# EAGLE design FlightControl (EAGLE 6.5.0)
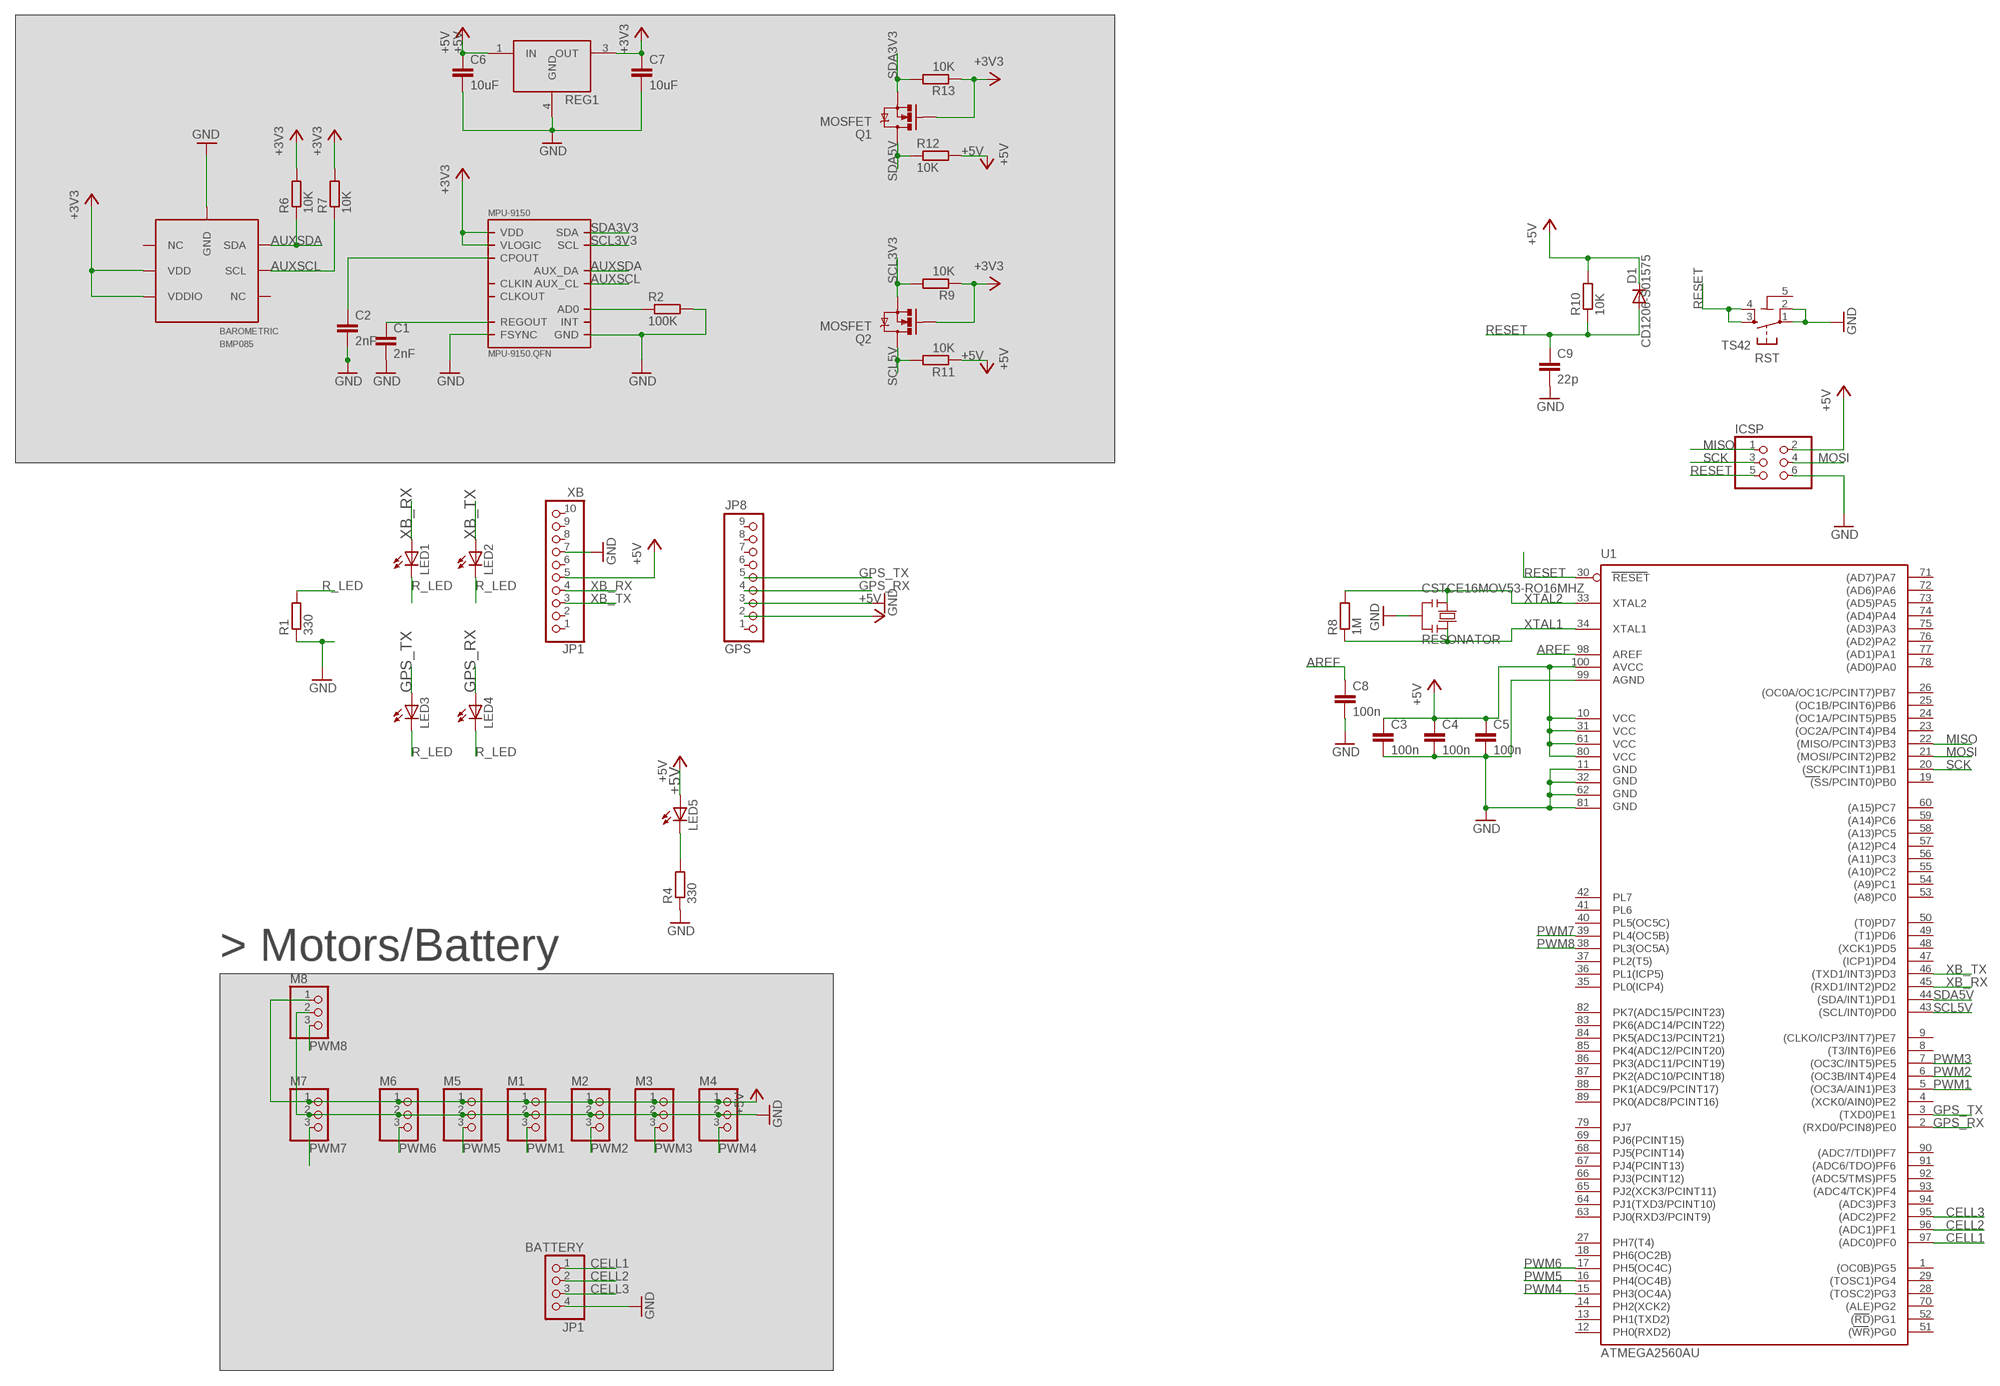
[diagram p0: schematic, sheet 1]

## Parts
BAROMETRIC  BMP085  [7LGA]
BATTERY  JP1  PINHD-1X4  [1X04]
C1  2nF  C-EUC0603  [C0603-ROUND]
C2  2nF  C-EUC0603  [C0603-ROUND]
C3  100n  C-EU0603-RND  [C0603-ROUND]
C4  100n  C-EU0603-RND  [C0603-ROUND]
C5  100n  C-EU0603-RND  [C0603-ROUND]
C6  10uF  CAPEZ  [CAP-PTH-SMALLEZ]
C7  10uF  CAPEZ  [CAP-PTH-SMALLEZ]
C8  100n  C-EU0603-RND  [C0603-ROUND]
C9  22p  C-EU0603-RND  [C0603-ROUND]
CSTCE16MOV53-RO16MHZ  RESONATOR  RESONATORMU  [RESONATOR]
D1  CD1206-S01575  DIODE-MINIMELF  [MINIMELF]
GPS  JP8  PINHD-1X9  [1X09]
ICSP  PINHD-2X3  [2X03]
JP1  XB  PINHD-1X10_ARD  [1X10]
LED1  LEDCHIPLED_1206  [CHIPLED_1206]
LED2  LEDCHIPLED_1206  [CHIPLED_1206]
LED3  LEDCHIPLED_1206  [CHIPLED_1206]
LED4  LEDCHIPLED_1206  [CHIPLED_1206]
LED5  LEDCHIPLED_1206  [CHIPLED_1206]
M1  PINHD-1X3  [1X03]
M2  PINHD-1X3  [1X03]
M3  PINHD-1X3  [1X03]
M4  PINHD-1X3  [1X03]
M5  PINHD-1X3  [1X03]
M6  PINHD-1X3  [1X03]
M7  PINHD-1X3  [1X03]
M8  PINHD-1X3  [1X03]
MPU-9150  MPU-9150.QFN  [QFN.24.4X4]
Q1  MOSFET  MOSFET-NCHANNELBSS138  [SOT23]
Q2  MOSFET  MOSFET-NCHANNELBSS138  [SOT23]
R1  330  R-EU_0603-RND  [R0603-ROUND]
R2  100K  R-EU_0603-RND  [R0603-ROUND]
R4  330  R-EU_0603-RND  [R0603-ROUND]
R6  10K  R-EU_0603-RND  [R0603-ROUND]
R7  10K  R-EU_0603-RND  [R0603-ROUND]
R8  1M  R-EU_R0603  [R0603-ROUND]
R9  10K  R-EU_R0603  [R0603-ROUND]
R10  10K  R-EU_R0603  [R0603-ROUND]
R11  10K  R-EU_R0603  [R0603-ROUND]
R12  10K  R-EU_R0603  [R0603-ROUND]
R13  10K  R-EU_R0603  [R0603-ROUND]
REG1  LD39300  [DPAK]
RST  TS42  [TS42]
U1  ATMEGA2560AU  [TQFP100]

## Nets
+3V3: BAROMETRIC.2(VDD) BAROMETRIC.3(VDDIO) C7.1 MPU-9150.3(VDD) MPU-9150.8(VLOGIC) MPU-9150.13(VDD) Q1.1(G) Q2.1(G) R6.2 R7.2 R9.1 R13.1 REG1.3(OUT)
+5V: C3.1 C4.1 C5.1 C6.1 D1.C GPS.2 ICSP.2 JP1.5 LED5.A M1.1 M2.1 M3.1 M4.1 M5.1 M6.1 M7.1 M8.1 R10.2 R11.1 R12.2 REG1.1(IN) U1.10(VCC) U1.31(VCC1) U1.61(VCC2) U1.80(VCC3) U1.100(AVCC)
AD0: MPU-9150.9(AD0) R2.1
AREF: C8.1 U1.98(AREF)
AUXSCL: BAROMETRIC.5(SCL) MPU-9150.7(AUX_CL) R7.1
AUXSDA: BAROMETRIC.6(SDA) MPU-9150.6(AUX_DA) R6.1
CELL1: BATTERY.1 U1.97((ADC0)PF0)
CELL2: BATTERY.2 U1.96((ADC1)PF1)
CELL3: BATTERY.3 U1.95((ADC2)PF2)
CPOUT: C2.1 MPU-9150.20(CPOUT)
GND: BAROMETRIC.7(GND) BATTERY.4 C1.2 C2.2 C3.2 C4.2 C5.2 C6.2 C7.2 C8.2 C9.2 CSTCE16MOV53-RO16MHZ.2 GPS.3 ICSP.6 JP1.7 M1.2 M2.2 M3.2 M4.2 M5.2 M6.2 M7.2 M8.2 MPU-9150.11(FSYNC) MPU-9150.15(GND) MPU-9150.17(GND) MPU-9150.18(GND) R1.1 R2.2 R4.1 REG1.4(GND) RST.1 RST.2 U1.11(GND) U1.32(GND1) U1.62(GND2) U1.81(GND3) U1.99(AGND)
GPS_RX: GPS.4 LED4.A U1.2((RXD0/PCIN8)PE0)
GPS_TX: GPS.5 LED3.A U1.3((TXD0)PE1)
MISO: ICSP.1 U1.22((MISO/PCINT3)PB3)
MOSI: ICSP.4 U1.21((MOSI/PCINT2)PB2)
N$7: LED5.C R4.2
PWM1: M1.3 U1.5((OC3A/AIN1)PE3)
PWM2: M2.3 U1.6((OC3B/INT4)PE4)
PWM3: M3.3 U1.7((OC3C/INT5)PE5)
PWM4: M4.3 U1.15(PH3(OC4A))
PWM5: M5.3 U1.16(PH4(OC4B))
PWM6: M6.3 U1.17(PH5(OC4C))
PWM7: M7.3 U1.39(PL4(OC5B))
PWM8: M8.3 U1.38(PL3(OC5A))
R_LED: LED1.C LED2.C LED3.C LED4.C R1.2
REGOUT: C1.1 MPU-9150.10(REGOUT)
RESET: C9.1 D1.A ICSP.5 R10.1 RST.3 RST.4 U1.30(RESET)
SCK: ICSP.3 U1.20((SCK/PCINT1)PB1)
SCL3V3: MPU-9150.23(SCL) Q2.2(S) R9.2
SCL5V: Q2.3(D) R11.2 U1.43((SCL/INT0)PD0)
SDA3V3: MPU-9150.24(SDA) Q1.2(S) R13.2
SDA5V: Q1.3(D) R12.1 U1.44((SDA/INT1)PD1)
XB_RX: JP1.4 LED1.A U1.45((RXD1/INT2)PD2)
XB_TX: JP1.3 LED2.A U1.46((TXD1/INT3)PD3)
XTAL1: CSTCE16MOV53-RO16MHZ.3 R8.1 U1.34(XTAL1)
XTAL2: CSTCE16MOV53-RO16MHZ.1 R8.2 U1.33(XTAL2)
Unconnected: BAROMETRIC.1(NC) BAROMETRIC.4(NC) GPS.1 GPS.6 GPS.7 GPS.8 GPS.9 JP1.1 JP1.2 JP1.6 JP1.8 JP1.9 JP1.10 MPU-9150.1(CLKIN) MPU-9150.12(INT) MPU-9150.22(CLKOUT) U1.1((OC0B)PG5) U1.4((XCK0/AIN0)PE2) U1.8((T3/INT6)PE6) U1.9((CLKO/ICP3/INT7)PE7) U1.12(PH0(RXD2)) U1.13(PH1(TXD2)) U1.14(PH2(XCK2)) U1.18(PH6(OC2B)) U1.19((SS/PCINT0)PB0) U1.23((OC2A/PCINT4)PB4) U1.24((OC1A/PCINT5)PB5) U1.25((OC1B/PCINT6)PB6) U1.26((OC0A/OC1C/PCINT7)PB7) U1.27(PH7(T4)) U1.28((TOSC2)PG3) U1.29((TOSC1)PG4) U1.35(PL0(ICP4)) U1.36(PL1(ICP5)) U1.37(PL2(T5)) U1.40(PL5(OC5C)) U1.41(PL6) U1.42(PL7) U1.47((ICP1)PD4) U1.48((XCK1)PD5) U1.49((T1)PD6) U1.50((T0)PD7) U1.51((WR)PG0) U1.52((RD)PG1) U1.53((A8)PC0) U1.54((A9)PC1) U1.55((A10)PC2) U1.56((A11)PC3) U1.57((A12)PC4) U1.58((A13)PC5) U1.59((A14)PC6) U1.60((A15)PC7) U1.63(PJ0(RXD3/PCINT9)) U1.64(PJ1(TXD3/PCINT10)) U1.65(PJ2(XCK3/PCINT11)) U1.66(PJ3(PCINT12)) U1.67(PJ4(PCINT13)) U1.68(PJ5(PCINT14)) U1.69(PJ6(PCINT15)) U1.70((ALE)PG2) U1.71((AD7)PA7) U1.72((AD6)PA6) U1.73((AD5)PA5) U1.74((AD4)PA4) U1.75((AD3)PA3) U1.76((AD2)PA2) U1.77((AD1)PA1) U1.78((AD0)PA0) U1.79(PJ7) U1.82(PK7(ADC15/PCINT23)) U1.83(PK6(ADC14/PCINT22)) U1.84(PK5(ADC13/PCINT21)) U1.85(PK4(ADC12/PCINT20)) U1.86(PK3(ADC11/PCINT19)) U1.87(PK2(ADC10/PCINT18)) U1.88(PK1(ADC9/PCINT17)) U1.89(PK0(ADC8/PCINT16)) U1.90((ADC7/TDI)PF7) U1.91((ADC6/TDO)PF6) U1.92((ADC5/TMS)PF5) U1.93((ADC4/TCK)PF4) U1.94((ADC3)PF3)

## Notes on the sheet
- > Motors/Battery

## Power pins joined to a net without a drawn wire
5-GND: RST.5(5-GND)

## Library data of the parts
BAROMETRIC = MyLibrary:BMP085
BATTERY = pinhead:PINHD-1X4: PIN HEADER
C1-C5 C8 C9 = SmartPrj:C-EU: CAPACITOR, European symbol
C6 C7 = SparkFun-Capacitors:CAP: Capacitor Standard 0603 ceramic capacitor, and 0.1" leaded capacitor.
CSTCE16MOV53-RO16MHZ = SmartPrj:RESONATOR
D1 = diode:DIODE-: DIODE
GPS = pinhead:PINHD-1X9: PIN HEADER
ICSP = SmartPrj:PINHD-2X3: PIN HEADER
JP1 = SmartPrj:PINHD-1X10_ARD: PIN HEADER
LED1-LED5 = adafruit:LED: LED OSRAM: - CHIPLED LG R971, LG N971, LY N971, LG Q971, LY Q971, LO R971, LY R971 LH N974, LH R974 LS Q976, LO Q976, LY Q976 LO Q996 - Hyper CHIPLED LW Q18S LB Q993, LB Q99A, LB R99A - SideLED LS A670, LO A670, LY A670, LG A670, LP A670 LB A673, LV A673, LT A673, LW A673 LH A674 LY A675 LS A676, LA A676, LO A676, LY A676, LW A676 LS A679, LY A679, LG A679 - Hyper Micro SIDELED® LS Y876, LA Y876, LO Y876, LY Y876 LT Y87S - SmartLED LW L88C, LW L88S LB L89C, LB L89S, LG L890 LS L89K, LO L89K, LY L89K LS L896, LA L896, LO L896, LY L896 - TOPLED LS T670, LO T670, LY T670, LG T670, LP T670 LSG T670, LSP T670, LSY T670, LOP T670, LYG T670 LG T671, LOG T671, LSG T671 LB T673, LV T673, LT T673, LW T673 LH T674 LS T676, LA T676, LO T676, LY T676, LB T676, LH T676, LSB T676, LW T676 LB T67C, LV T67C, LT T67C, LS T67K, LO T67K, LY T67K, LW E67C LS E67B, LA E67B, LO E67B, LY E67B, LB E67C, LV E67C, LT E67C LW T67C LS T679, LY T679, LG T679 LS T770, LO T770, LY T770, LG T770, LP T770 LB T773, LV T773, LT T773, LW T773 LH T774 LS E675, LA E675, LY E675, LS T675 LS T776, LA T776, LO T776, LY T776, LB T776 LHGB T686 LT T68C, LB T68C - Hyper Mini TOPLED® LB M676 - Mini TOPLED Santana® LG M470 LS M47K, LO M47K, LY M47K Source: http://www.osram.convergy.de/
M1-M8 = pinhead:PINHD-1X3: PIN HEADER
MPU-9150 = invensense:MPU-9150
Q1 Q2 = SparkFun-DiscreteSemi:MOSFET-NCHANNEL: Common NMOSFET Parts MFG P/N Store ID Prod ID FDD8780 TRANS-09984 SI7820DN TRANS-11055 FDS6630A IC-08089 2N7002PW TRANS-11151 FQP30N06L COM-10213 TRANS-10060 BSS123LT1G TRANS-08345 BSS138 TRANS-00830 BS170 2N7000; PROD_ID: TRANS-00830
R1 R2 R4 R6-R13 = SmartPrj:R-EU_: RESISTOR, European symbol
REG1 = v-reg:LD39300
RST = SmartPrj:TS42: TS42 Dongnan Electronics Tact switch VDC 12V - 50mA
U1 = SparkFun-DigitalIC:ATMEGA2560: Atmel 100-pin 8-bit uC 64/128/256 Kbytes FLASH 4 Kbytes EEPROM 8 Kbytes SRAM 86 General Purpose I/O pins 12-channels16-bit PWM 4 x Serial USARTs 16-channels 10-bit A/D

## Net classes
0 default: clearance 0.205 mm

## Board
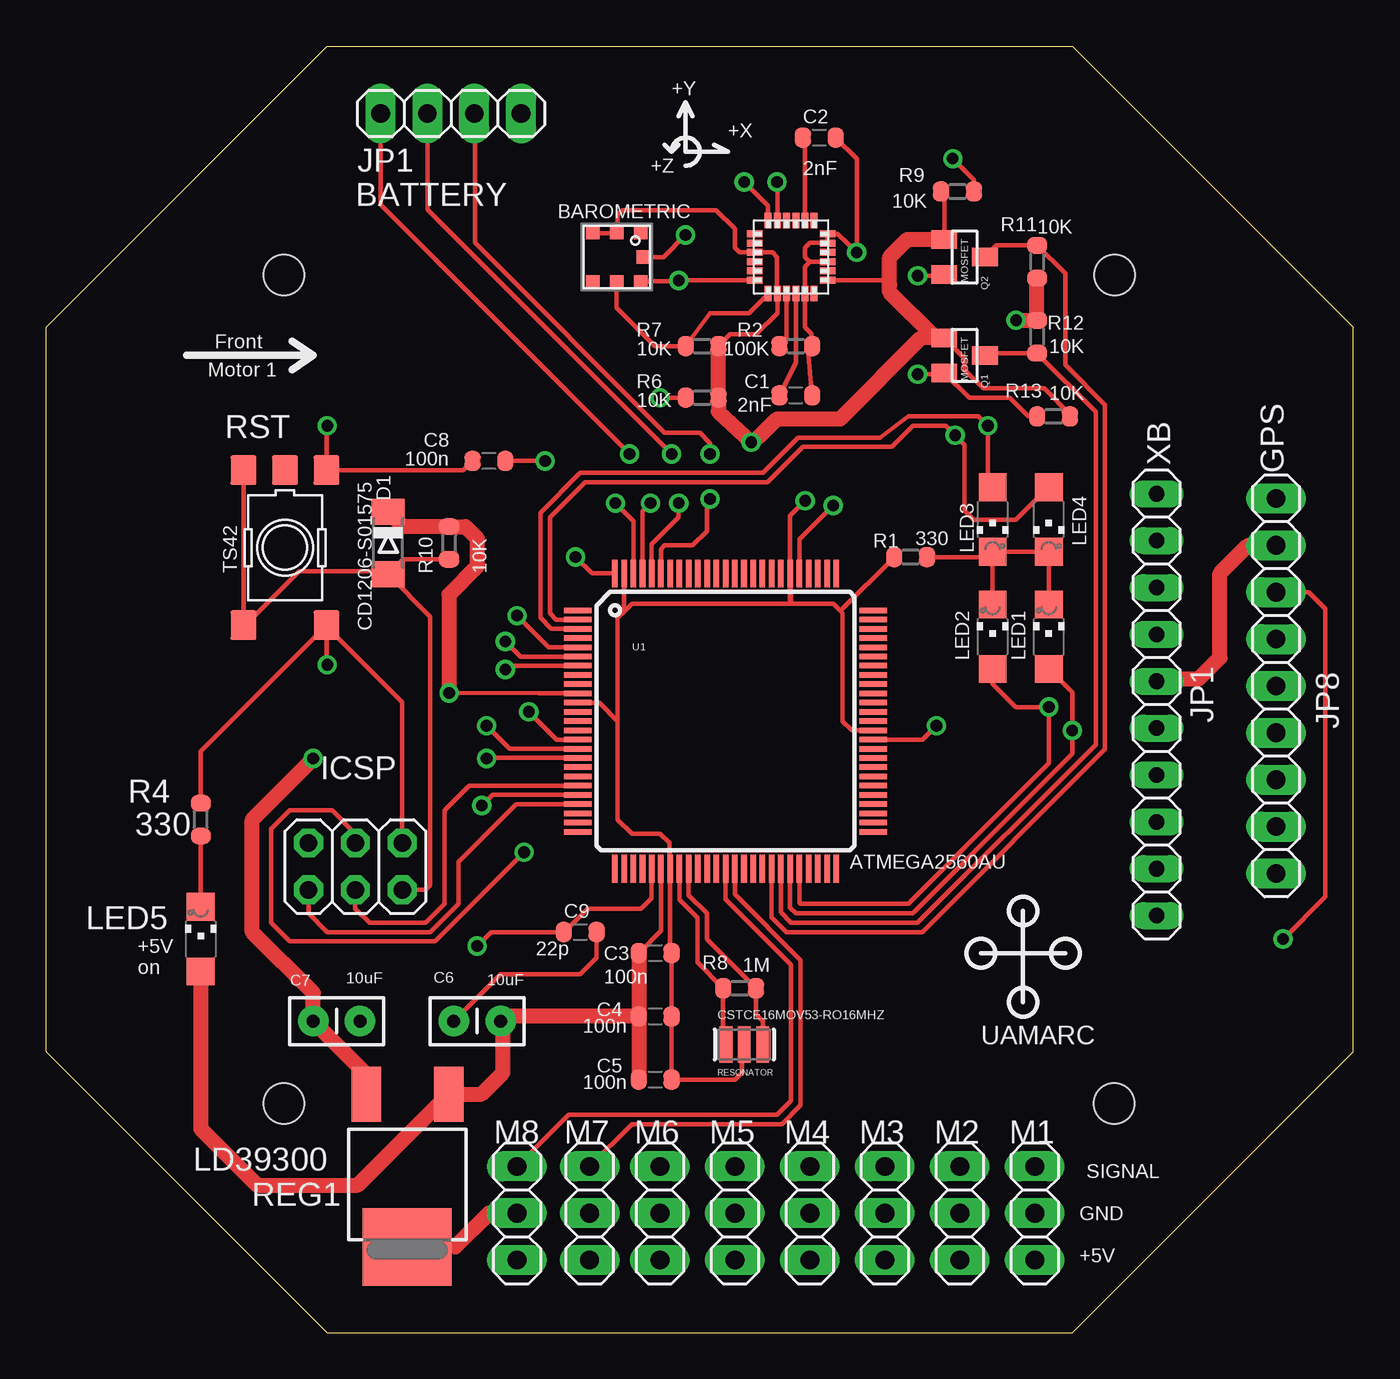
[diagram p1: board, top side]
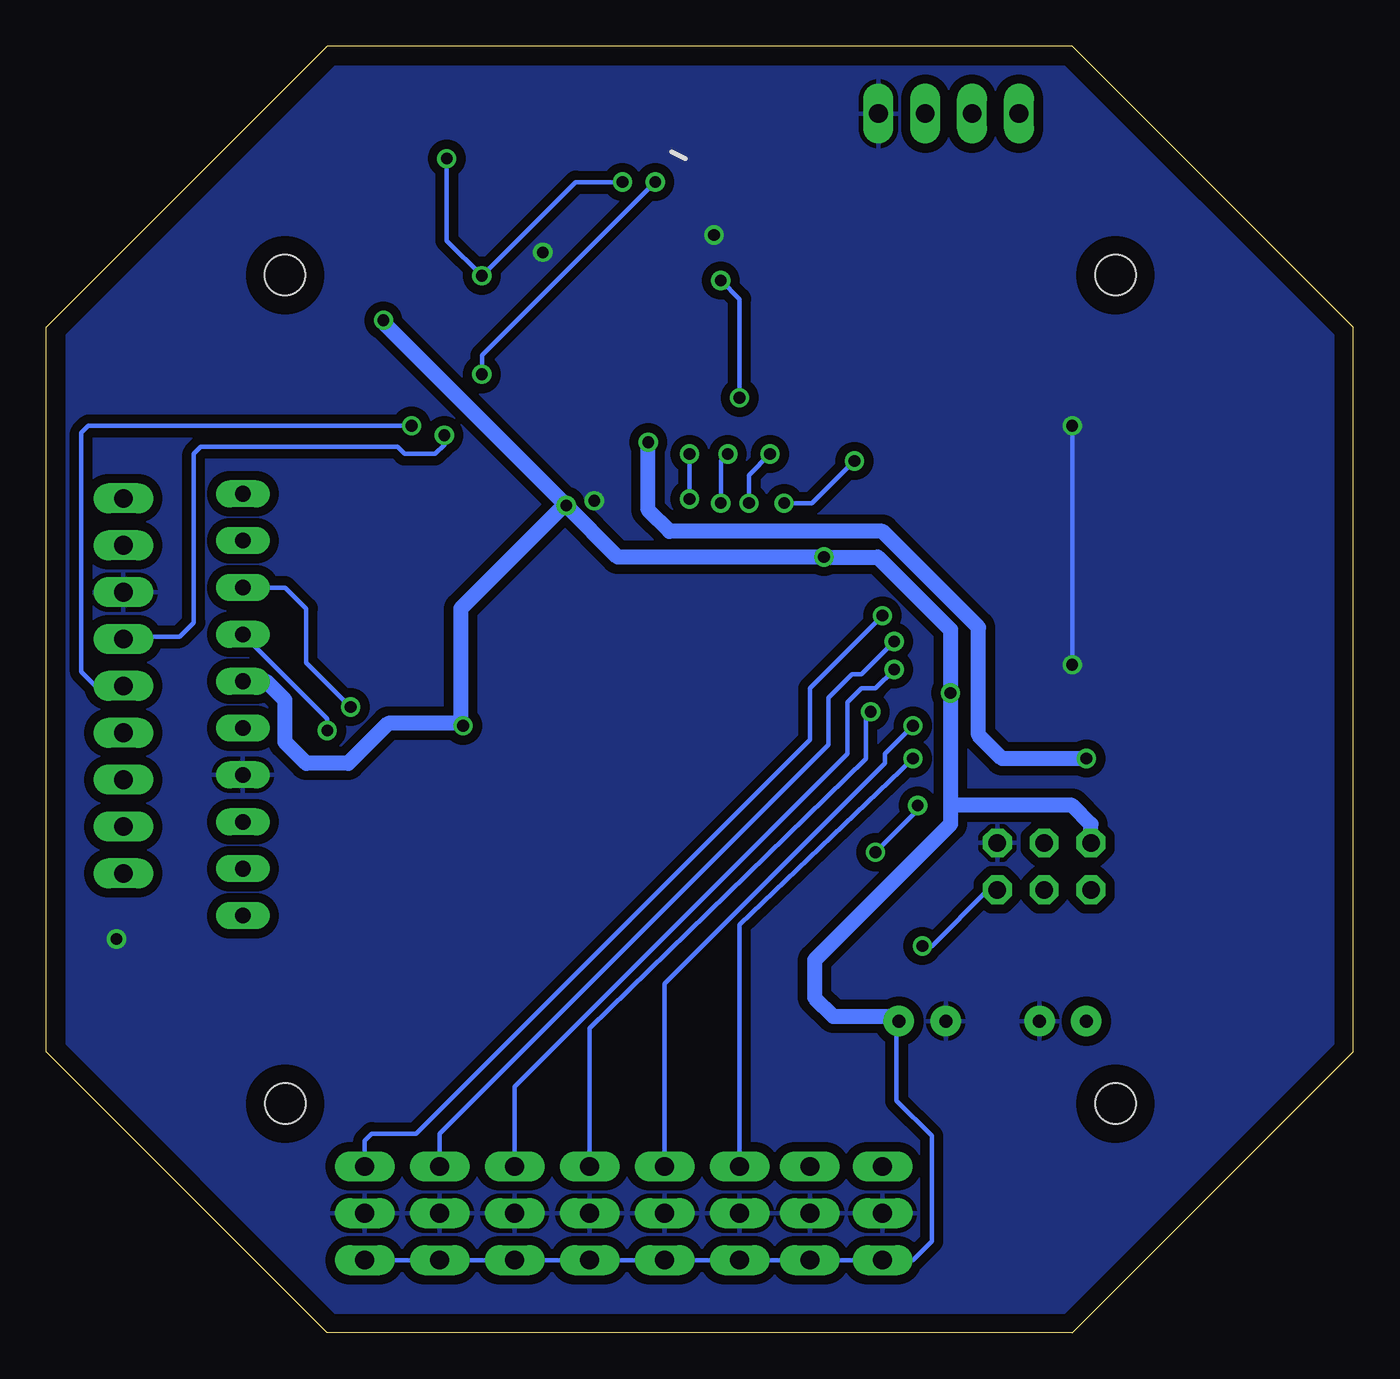
[diagram p2: board, bottom side, seen from below]

Size 70.87 x 69.72 mm. Coordinates in mm from the lower left corner, seen from the top.
Outline: 0,15.24 0,54.48 15.24,69.72 55.63,69.72 70.87,54.48 70.87,15.24 55.63,0 15.24,0 0,15.24
Copper layers (1*16): Top 0.035mm / dielectric 1.5mm / Bottom 0.035mm
Design rules "FlightControl *": minimum track width 10mil, minimum drill 24mil, track to track 7mil, track to pad 7mil, pad to pad 7mil, via to via 7mil, smd to smd 0mil, copper to edge 40mil, drill to drill 8mil, minimum pad ring 12mil, minimum via ring 8mil, stop-mask expansion 4mil, vias tented up to drill 25mil, thermal gap 10mil
Holes 2.2 mm at 57.9,12.41 12.9,12.41 12.9,57.31 57.91,57.32

### Footprints (pad centres in the part's own frame; a part is rotated, then mirrored left to right if it is on the bottom)
7LGA = smd 0.75 x 0.65: 1 1.5,1.3; 2 0.2,1.3; 3 -1.1,1.3; 4 -1.1,-1.3; 5 0.2,-1.3; 6 1.5,-1.3 | smd 0.65 x 0.75: 7 1.6,0
1X04 = drill 1.016 long: 1 -3.81,0; 2 -1.27,0; 3 1.27,0; 4 3.81,0
C0603-ROUND = smd 0.898 x 1.1: 1 -0.889,0; 2 0.889,0
CAP-PTH-SMALLEZ = drill 0.7 pad 1.651: 1 0,0; 2 2.54,0
RESONATOR = smd 0.7 x 2: 1 -1,0; 2 0,0; 3 1,0
MINIMELF = smd 1.4 x 1.8: A 1.7,0; C -1.7,0
1X09 = drill 1.016 long: 1 -10.16,0; 2 -7.62,0; 3 -5.08,0; 4 -2.54,0; 5 0,0; 6 2.54,0; 7 5.08,0; 8 7.62,0; 9 10.16,0
2X03 = drill 0.95 pad 1.55 octagon: 1 -2.54,-1.27; 2 -2.54,1.27; 3 0,-1.27; 4 0,1.27; 5 2.54,-1.27; 6 2.54,1.27
1X10 = drill 0.85 pad 1.422 long: 1 -11.43,0; 2 -8.89,0; 3 -6.35,0; 4 -3.81,0; 5 -1.27,0; 6 1.27,0; 7 3.81,0; 8 6.35,0; 9 8.89,0; 10 11.43,0
CHIPLED_1206 = smd 1.5 x 1.5: A 0,-1.75; C 0,1.75
1X03 = drill 1.016 long: 1 -2.54,0; 2 0,0; 3 2.54,0
QFN.24.4X4 = smd 0.85 x 0.38: 1 -1.975,1.25; 2 -1.975,0.75; 3 -1.975,0.25; 4 -1.975,-0.25; 5 -1.975,-0.75; 6 -1.975,-1.25; 13 1.975,-1.25; 14 1.975,-0.75; 15 1.975,-0.25; 16 1.975,0.25; 17 1.975,0.75; 18 1.975,1.25 | smd 0.38 x 0.85: 7 -1.25,-1.975; 8 -0.75,-1.975; 9 -0.25,-1.975; 10 0.25,-1.975; 11 0.75,-1.975; 12 1.25,-1.975; 19 1.25,1.975; 20 0.75,1.975; 21 0.25,1.975; 22 -0.25,1.975; 23 -0.75,1.975; 24 -1.25,1.975
SOT23 = smd 1 x 1.4: 1 -0.95,-1.1; 2 0.95,-1.1; 3 0,1.1
R0603-ROUND = smd 0.898 x 1.1: 1 -0.889,0; 2 0.889,0
DPAK = smd 1.6 x 2.997: 1 -2.261,-4.928; 3 2.21,-4.928 | smd 4.826 x 4.191: 4 0,3.353
TS42 = smd 1.6 x 1.4: 1 -4.2,2.25; 2 4.2,2.25; 3 -4.2,-2.25; 4 4.2,-2.25; 5 -4.2,0
TQFP100 = smd 1.5 x 0.3: 1 -8,6; 2 -8,5.5; 3 -8,5; 4 -8,4.5; 5 -8,4; 6 -8,3.5; 7 -8,3; 8 -8,2.5; 9 -8,2; 10 -8,1.5; 11 -8,1; 12 -8,0.5; 13 -8,0; 14 -8,-0.5; 15 -8,-1; 16 -8,-1.5; 17 -8,-2; 18 -8,-2.5; 19 -8,-3; 20 -8,-3.5; 21 -8,-4; 22 -8,-4.5; 23 -8,-5; 24 -8,-5.5; 25 -8,-6; 51 8,-6; 52 8,-5.5; 53 8,-5; 54 8,-4.5; 55 8,-4; 56 8,-3.5; 57 8,-3; 58 8,-2.5; 59 8,-2; 60 8,-1.5; 61 8,-1; 62 8,-0.5; 63 8,0; 64 8,0.5; 65 8,1; 66 8,1.5; 67 8,2; 68 8,2.5; 69 8,3; 70 8,3.5; 71 8,4; 72 8,4.5; 73 8,5; 74 8,5.5; 75 8,6 | smd 0.3 x 1.5: 26 -6,-8; 27 -5.5,-8; 28 -5,-8; 29 -4.5,-8; 30 -4,-8; 31 -3.5,-8; 32 -3,-8; 33 -2.5,-8; 34 -2,-8; 35 -1.5,-8; 36 -1,-8; 37 -0.5,-8; 38 0,-8; 39 0.5,-8; 40 1,-8; 41 1.5,-8; 42 2,-8; 43 2.5,-8; 44 3,-8; 45 3.5,-8; 46 4,-8; 47 4.5,-8; 48 5,-8; 49 5.5,-8; 50 6,-8; 76 6,8; 77 5.5,8; 78 5,8; 79 4.5,8; 80 4,8; 81 3.5,8; 82 3,8; 83 2.5,8; 84 2,8; 85 1.5,8; 86 1,8; 87 0.5,8; 88 0,8; 89 -0.5,8; 90 -1,8; 91 -1.5,8; 92 -2,8; 93 -2.5,8; 94 -3,8; 95 -3.5,8; 96 -4,8; 97 -4.5,8; 98 -5,8; 99 -5.5,8; 100 -6,8

### Placement (x,y rotation side)
BAROMETRIC  30.73,58.29 0 top
BATTERY  21.94,66.07 0 top
C1  40.64,50.8 0 top
C2  41.91,64.77 0 top
C3  33.02,20.57 0 top
C4  33.02,17.14 0 top
C5  33.02,13.72 0 top
C6  24.64,16.89 180 top
C7  14.48,16.89 0 top
C8  24,47.24 180 top
C9  28.96,21.72 0 top
CSTCE16MOV53-RO16MHZ  37.85,15.62 0 top
D1  18.54,42.8 270 top
GPS  66.67,35.05 270 top
ICSP  16.76,25.27 0 top
JP1  60.2,34.04 270 top
LED1  54.36,37.72 0 top
LED2  51.31,37.72 0 top
LED3  51.31,44.07 180 top
LED4  54.36,44.07 180 top
LED5  8.38,21.34 0 top
M1  53.59,6.48 90 top
M2  49.53,6.48 90 top
M3  45.47,6.48 90 top
M4  41.4,6.48 90 top
M5  37.34,6.48 90 top
M6  33.27,6.48 90 top
M7  29.46,6.48 90 top
M8  25.53,6.48 90 top
MPU-9150  40.39,58.29 0 top
Q1  49.78,52.96 270 top
Q2  49.78,58.29 270 top
R1  46.86,42.04 0 top
R2  40.64,53.47 0 top
R4  8.38,27.81 270 top
R6  35.56,50.67 0 top
R7  35.56,53.47 0 top
R8  37.59,18.67 180 top
R9  49.4,61.85 0 top
R10  21.84,42.8 90 top
R11  53.72,58.04 90 top
R12  53.72,53.98 90 top
R13  54.61,49.66 180 top
REG1  19.56,8 180 top
RST  12.95,42.55 270 top
U1  36.83,33.15 0 top

### Tracks (layer width: path | path; a pad name or v marks a point on that pad's centre or on a via)
+3V3  (via drill 0.64)
  Top 0.254: Q1.1 49.78,52.81 49.78,52.2 50.8,51.18 54.1,51.18 55.5,49.78 R13.1 | BAROMETRIC.3 BAROMETRIC.2 30.99,59.65 30.99,60.58 31.24,60.83 36.32,60.83 37.34,59.82 37.34,58.8 37.6,58.54 MPU-9150.3 39.37,58.54 39.62,58.29 39.62,56.33 MPU-9150.8 39.64,55.26 38.48,54.1 37.08,54.1 R7.2 | 48.5,59.05 Q2.1 48.68,61.68 R9.1 | REG1.3 17.35,14.02 | MPU-9150.13 45.45,57.04 45.72,56.77
  Top 0.813: v14.48,31.12 11.18,27.81 11.18,21.72 14.48,18.41 C7.1 17.35,14.02 | R7.2 R6.2 36.45,49.91 v38.23,48.26 38.73,48.64 39.62,49.53 43.05,49.53 47.43,53.91 Q1.1 48.2,53.91 45.72,56.39 45.72,56.77 45.72,58.29 46.67,59.24 Q2.1
  Bottom 0.813: v14.48,31.12 19.05,31.12 20.32,32.38 20.32,38.23 25.53,43.43 37.08,43.43 38.23,44.58 v38.23,48.26
+5V  (via drill 0.64)
  Top 0.254: U1.61 47.51,32.15 v48.26,32.89 | U1.80 40.83,42.99 v42.67,44.83 | 30.83,41.18 U1.100 29.59,41.15 v28.7,42.04 | U1.10 26.69,34.65 v21.84,34.67 | U1.31 33.33,21.77 C3.1 | 24.89,17.14 C6.1
  Top 0.813: C3.1 C4.1 | C4.1 C5.1 | D1.C 19.35,43.69 R10.2 22.73,43.69 23.37,43.05 23.37,41.53 21.84,40.01 v21.84,34.67 | R11.1 R12.2 v52.58,54.86 | C4.1 24.89,17.14 | C6.1 24.77,16.76 24.77,14.1 23.6,12.93 REG1.1 16.89,8 11.43,8 8.38,11.05 LED5.A | JP1.5 60.33,35.43 62.48,35.43 63.63,36.58 63.63,41.15 65.15,42.67 GPS.2
  Bottom 0.254: M1.1 M2.1 M3.1 M4.1 M5.1 M6.1 M7.1 M8.1 23.88,3.94 22.86,4.95 22.86,10.67 24.77,12.57 24.77,16.76 | 24.89,17.14 C6.1 | 52.58,54.74 v52.58,54.86
  Bottom 0.813: 21.84,28.58 v21.84,34.67 21.84,38.1 25.78,42.04 v28.7,42.04 39.88,42.04 v42.67,44.83 | 21.84,28.58 21.84,27.56 29.21,20.19 29.21,18.16 28.19,17.14 24.89,17.14 | v42.67,44.83 52.58,54.74 | ICSP.2 14.22,27.56 15.24,28.58 21.84,28.58 | C6.1 24.77,16.76 | v42.67,44.83 42.8,44.83 48.39,39.24 48.39,33.02 | 48.39,33.02 v48.26,32.89 | 48.39,33.02 52.32,33.02 54.48,30.86 56.77,30.86 57.91,32 57.91,34.29 58.93,35.31 JP1.5
AD0
  Top 0.254: MPU-9150.9 40.14,53.81 R2.1
AREF  (via drill 0.64)
  Top 0.254: U1.98 31.83,43.99 v30.86,44.96 | C8.1 v27.05,47.24
  Bottom 0.254: v30.86,44.96 29.34,44.96 v27.05,47.24
AUXSCL
  Top 0.254: 34.46,53.47 R7.1 | R7.1 35.98,55.24 38.1,55.24 38.88,56.03 MPU-9150.7 | BAROMETRIC.5 30.93,55.55 33.02,53.47 R7.1
AUXSDA  (via drill 0.64)
  Top 0.254: R6.1 v33.27,50.67 | BAROMETRIC.6 34.26,56.99 v34.29,57.02 34.31,57.04 MPU-9150.6
  Bottom 0.254: v33.27,50.67 33.27,56.01 v34.29,57.02
CELL1  (via drill 0.64)
  Top 0.254: BATTERY.1 18.13,61.12 v31.62,47.62 | v32.77,44.96 32.33,44.52 U1.97
  Bottom 0.254: v31.62,47.62 32.77,46.48 v32.77,44.96
CELL2  (via drill 0.64)
  Top 0.254: BATTERY.2 20.67,60.86 v33.91,47.62 | U1.96 32.83,42.74 34.29,44.2 v34.29,44.96
  Bottom 0.254: v33.91,47.62 34.29,47.24 v34.29,44.96
CELL3  (via drill 0.64)
  Top 0.254: U1.95 33.33,41.33 33.33,42.47 33.53,42.67 35.05,42.67 35.81,43.43 35.81,45.01 v35.99,45.19 | 23.37,65.91 BATTERY.3 23.24,66.04 23.24,59.05 33.53,48.77 35.43,48.77 35.99,48.21 v35.99,47.62
  Bottom 0.254: v35.99,47.62 v35.99,45.19
CPOUT
  Top 0.254: MPU-9150.20 41.14,64.65 C2.1
GND  (via drill 0.64)
  Top 0.254: C1.2 41.29,53.27 R2.2 41.49,54.14 41.15,54.48 41.15,56.31 MPU-9150.11 41.14,57.77 41.4,58.04 MPU-9150.15 41.4,58.04 41.15,58.29 41.15,58.8 41.4,59.05 42.35,59.05 MPU-9150.17 MPU-9150.18 42.91,59.54 v43.94,58.55 43.94,63.63 C2.2 | U1.11 29.99,34.15 30.99,33.15 | 30.99,33.15 30.99,27.81 31.75,27.05 33.27,27.05 33.78,26.54 33.78,25.2 U1.32 33.83,20.65 C3.2 C4.2 C5.2 37.34,13.72 37.72,14.1 37.72,15.49 CSTCE16MOV53-RO16MHZ.2 | U1.99 31.33,39.08 | 31.33,39.08 30.99,38.73 30.99,33.15 | U1.62 43.68,32.65 43.18,33.15 43.18,38.99 43.05,39.12 | 43.05,39.12 42.67,39.5 40.39,39.5 | 40.39,39.5 40.39,39.75 U1.81 | U1.81 40.33,39.55 40.39,39.5 | 40.39,39.5 31.75,39.5 31.33,39.08 | U1.81 40.33,44.27 v41.15,45.09 | BAROMETRIC.7 33.47,58.29 v34.66,59.49 | R1.1 43.05,39.12 | RST.2 15.5,37.96 19.3,34.16 ICSP.6 | REG1.4 22.17,4.65 | 24,6.48 M8.2 | C8.2 22.61,46.74 RST.1 15.2,49.11 v15.24,49.15 | C9.2 29.84,20.32 28.96,19.43 24.64,19.43 C6.2 | R4.1 8.38,31.52 RST.2 | RST.2 15.2,36.23 v15.24,36.2 | GPS.3 68.45,40.13 69.34,39.24 69.34,23.62 v67.06,21.34
  Top 0.813: 22.17,4.65 24,6.48
  Bottom 0.254: v15.24,49.15 v15.24,36.2
  pour Bottom (isolate 0.5): 0.51,0.76 70.36,0.38 70.36,69.21 0.89,69.21
GPS_RX  (via drill 0.64)
  Top 0.254: U1.2 27.65,38.65 27.3,38.99 27.3,44.2 29.21,46.1 39.12,46.1 41.02,48.01 45.85,48.01 46.99,49.15 48.77,49.15 v49.28,48.64 49.78,48.13 49.78,44.58 50.29,44.07 52.58,44.07 54.33,45.82 LED4.A
  Bottom 0.254: GPS.4 65.41,37.72 63.63,37.72 62.87,38.48 62.87,47.62 62.48,48.01 51.82,48.01 51.44,47.62 49.78,47.62 49.28,48.13 v49.28,48.64
GPS_TX  (via drill 0.64)
  Top 0.254: U1.3 27.39,38.15 26.8,38.73 26.8,44.45 28.96,46.61 38.86,46.61 40.77,48.51 45.21,48.51 46.74,49.66 50.55,49.66 v51.05,49.15 51.05,46.07 LED3.A
  Bottom 0.254: GPS.5 68.2,35.05 68.96,35.81 68.96,48.77 68.58,49.15 v51.05,49.15
MISO
  Top 0.254: ICSP.1 14.22,22.73 15.24,21.72 20.83,21.72 22.35,23.24 22.35,25.53 25.47,28.65 U1.22
MOSI  (via drill 0.64)
  Top 0.254: ICSP.4 16.76,27.05 15.49,28.32 13.21,28.32 12.19,27.3 12.19,22.23 13.21,21.21 21.08,21.21 v25.91,26.04 | U1.21 24.19,29.15 v23.62,28.58
  Bottom 0.254: v23.62,28.58 23.62,28.32 v25.91,26.04
N$7
  Top 0.254: LED5.C R4.2
PWM1  (via drill 0.64)
  Top 0.254: U1.5 27.24,37.15 v25.53,38.86
  Bottom 0.254: M1.3 53.59,10.41 53.21,10.79 50.8,10.79 29.46,32.13 29.46,34.93 v25.53,38.86
PWM2  (via drill 0.64)
  Top 0.254: U1.6 25.71,36.65 v24.89,37.47
  Bottom 0.254: M2.3 49.53,10.79 28.45,31.88 28.45,34.42 27.18,35.69 26.67,35.69 v24.89,37.47
PWM3  (via drill 0.64)
  Top 0.254: U1.7 25.1,36.15 v24.89,35.94
  Bottom 0.254: M3.3 45.47,13.33 27.43,31.37 27.43,34.16 26.67,34.93 25.91,34.93 v24.89,35.94
PWM4  (via drill 0.64)
  Top 0.254: U1.15 27.67,32.15 v26.16,33.66
  Bottom 0.254: M4.3 41.4,16.51 26.42,31.12 26.42,33.4 v26.16,33.66
PWM5  (via drill 0.64)
  Top 0.254: U1.16 25.12,31.65 v23.88,32.89
  Bottom 0.254: M5.3 37.34,18.92 25.4,30.86 25.4,31.37 v23.88,32.89
PWM6  (via drill 0.64)
  Top 0.254: U1.17 23.91,31.15 v23.88,31.12
  Bottom 0.254: M6.3 33.27,22.1 v23.88,31.12
PWM7
  Top 0.254: U1.39 37.33,23.76 40.89,20.19 40.89,12.32 39.88,11.3 31.75,11.3 M7.3
PWM8
  Top 0.254: U1.38 36.83,23.49 40.39,19.94 40.39,12.57 39.62,11.81 28.32,11.81 M8.3
R_LED
  Top 0.254: LED1.C LED4.C LED3.C | LED3.C 50.7,42.32 | LED3.C LED2.C | R1.2 51.03,42.04 LED3.C
REGOUT
  Top 0.254: MPU-9150.10 40.64,52.58 C1.1
RESET  (via drill 0.64)
  Top 0.254: U1.30 32.83,23.56 32.26,22.99 29.34,22.99 C9.1 24.13,21.72 v23.37,20.95 | RST.3 RST.4 10.79,38.34 13.72,41.27 18.37,41.27 D1.A | R10.1 19.35,41.91 D1.A | ICSP.5 20.57,24 20.83,24.26 20.83,38.81 D1.A
  Bottom 0.254: v23.37,20.95 22.86,20.95 19.81,24 ICSP.5
SCK
  Top 0.254: ICSP.3 16.76,22.99 17.53,22.23 20.57,22.23 21.59,23.24 21.59,28.32 22.92,29.65 U1.20
SCL3V3  (via drill 0.64)
  Top 0.254: MPU-9150.23 39.64,62.35 v39.62,62.36 | Q2.2 48.62,57.28 v47.24,57.28 | R9.2 50.29,62.48 v49.15,63.63
  Bottom 0.254: v39.62,62.36 42.16,62.36 v47.24,57.28 49.15,59.18 v49.15,63.63
SCL5V
  Top 0.254: U1.43 39.33,22.52 40.13,21.72 47.5,21.72 57.4,31.62 57.4,50.29 55.24,52.45 55.24,57.4 R11.2 51.52,58.93 Q2.3
SDA3V3  (via drill 0.64)
  Top 0.254: MPU-9150.24 39.14,61.07 v37.85,62.36 | v47.24,51.94 48.62,51.94 Q1.2 48.7,52.01 50.04,50.67 52.24,50.67 53.25,49.66 R13.2
  Bottom 0.254: v47.24,51.94 47.24,52.96 v37.85,62.36
SDA5V
  Top 0.254: Q1.3 51.01,53.09 R12.1 56.9,49.91 56.9,31.88 47.24,22.23 40.39,22.23 39.83,22.78 U1.44
XB_RX  (via drill 0.64)
  Top 0.254: U1.45 40.33,23.04 40.64,22.73 46.99,22.73 55.63,31.37 v55.63,32.64 55.63,34.7 LED1.A
  Bottom 0.254: JP1.4 55.63,33.27 v55.63,32.64
XB_TX  (via drill 0.64)
  Top 0.254: U1.46 40.83,23.3 40.89,23.24 46.74,23.24 54.36,30.86 v54.36,33.91 52.58,33.91 51.31,35.18 LED2.A
  Bottom 0.254: v54.36,33.91 56.77,36.32 56.77,39.24 57.91,40.39 JP1.3
XTAL1
  Top 0.254: U1.34 34.83,23.72 35.81,22.73 35.81,21.34 R8.1 38.48,17.27 38.86,16.89 38.86,15.64 CSTCE16MOV53-RO16MHZ.3
XTAL2
  Top 0.254: U1.33 34.33,23.45 35.31,22.48 35.31,20.07 R8.2 36.7,15.76 CSTCE16MOV53-RO16MHZ.1

### Text on the board
tPlace: +Y | +X | +Z | Front | Motor 1 | +5V / on | UAMARC | SIGNAL | GND | +5V